# Altium project Smart Energy System.PrjPcb
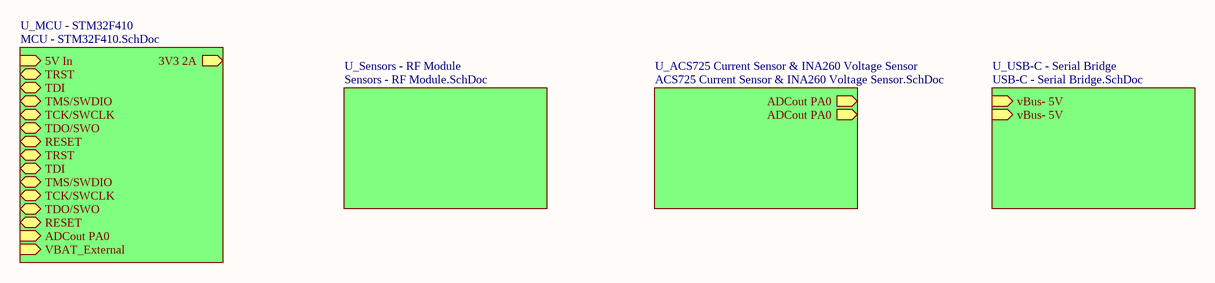
[diagram p0: Smart Energy Monitoring System.SchDoc]
6 sheets, 79 parts. Net scope: hierarchical (ports join the sheet entries above them; power ports are global).
Board file: Energy Managment System.PcbDoc
Sheets:
  Smart Energy Monitoring System.SchDoc
    U_MCU - STM32F410 = MCU - STM32F410.SchDoc
    U_Sensors - RF Module = Sensors - RF Module.SchDoc
    U_ACS725 Current Sensor & INA260 Voltage Sensor = ACS725 Current Sensor & INA260 Voltage Sensor.SchDoc
    U_USB-C - Serial Bridge = USB-C - Serial Bridge.SchDoc
  Functional Diagram.SchDoc

## Sheet Smart Energy Monitoring System.SchDoc
size A4; SheetNumber: 1; SheetTotal: 6

### Sub-sheets
U_ACS725 Current Sensor & INA260 Voltage Sensor = ACS725 Current Sensor & INA260 Voltage Sensor.SchDoc: ADCout PA0 (out), ADCout PA0 (out)
U_MCU - STM32F410 = MCU - STM32F410.SchDoc: 5V In (in), 3V3 2A (out), TRST (bidir), TDI (bidir), TMS/SWDIO (bidir), TCK/SWCLK (bidir), TDO/SWO (bidir), RESET (bidir), TRST (bidir), TDI (bidir), TMS/SWDIO (bidir), TCK/SWCLK (bidir), TDO/SWO (bidir), RESET (bidir), ADCout PA0 (in), VBAT_External (in)
U_Sensors - RF Module = Sensors - RF Module.SchDoc: no entries
U_USB-C - Serial Bridge = USB-C - Serial Bridge.SchDoc: vBus- 5V (in), vBus- 5V (in)

### Nets
NRST: sheet U_MCU - STM32F410/RESET, sheet U_MCU - STM32F410/RESET
NetJ?#1_3: sheet U_MCU - STM32F410/TRST, sheet U_MCU - STM32F410/TRST
NetJ?#1_5: sheet U_MCU - STM32F410/TDI, sheet U_MCU - STM32F410/TDI
NetJ?#1_7: sheet U_MCU - STM32F410/TMS/SWDIO, sheet U_MCU - STM32F410/TMS/SWDIO
NetJ?#1_9: sheet U_MCU - STM32F410/TCK/SWCLK, sheet U_MCU - STM32F410/TCK/SWCLK
NetJ?#1_13: sheet U_MCU - STM32F410/TDO/SWO, sheet U_MCU - STM32F410/TDO/SWO
(unnamed): sheet U_ACS725 Current Sensor & INA260 Voltage Sensor/ADCout PA0, sheet U_ACS725 Current Sensor & INA260 Voltage Sensor/ADCout PA0
(unnamed): sheet U_USB-C - Serial Bridge/vBus- 5V, sheet U_USB-C - Serial Bridge/vBus- 5V

## Sheet MCU - STM32F410.SchDoc
size A4; SheetNumber: 4; SheetTotal: 5
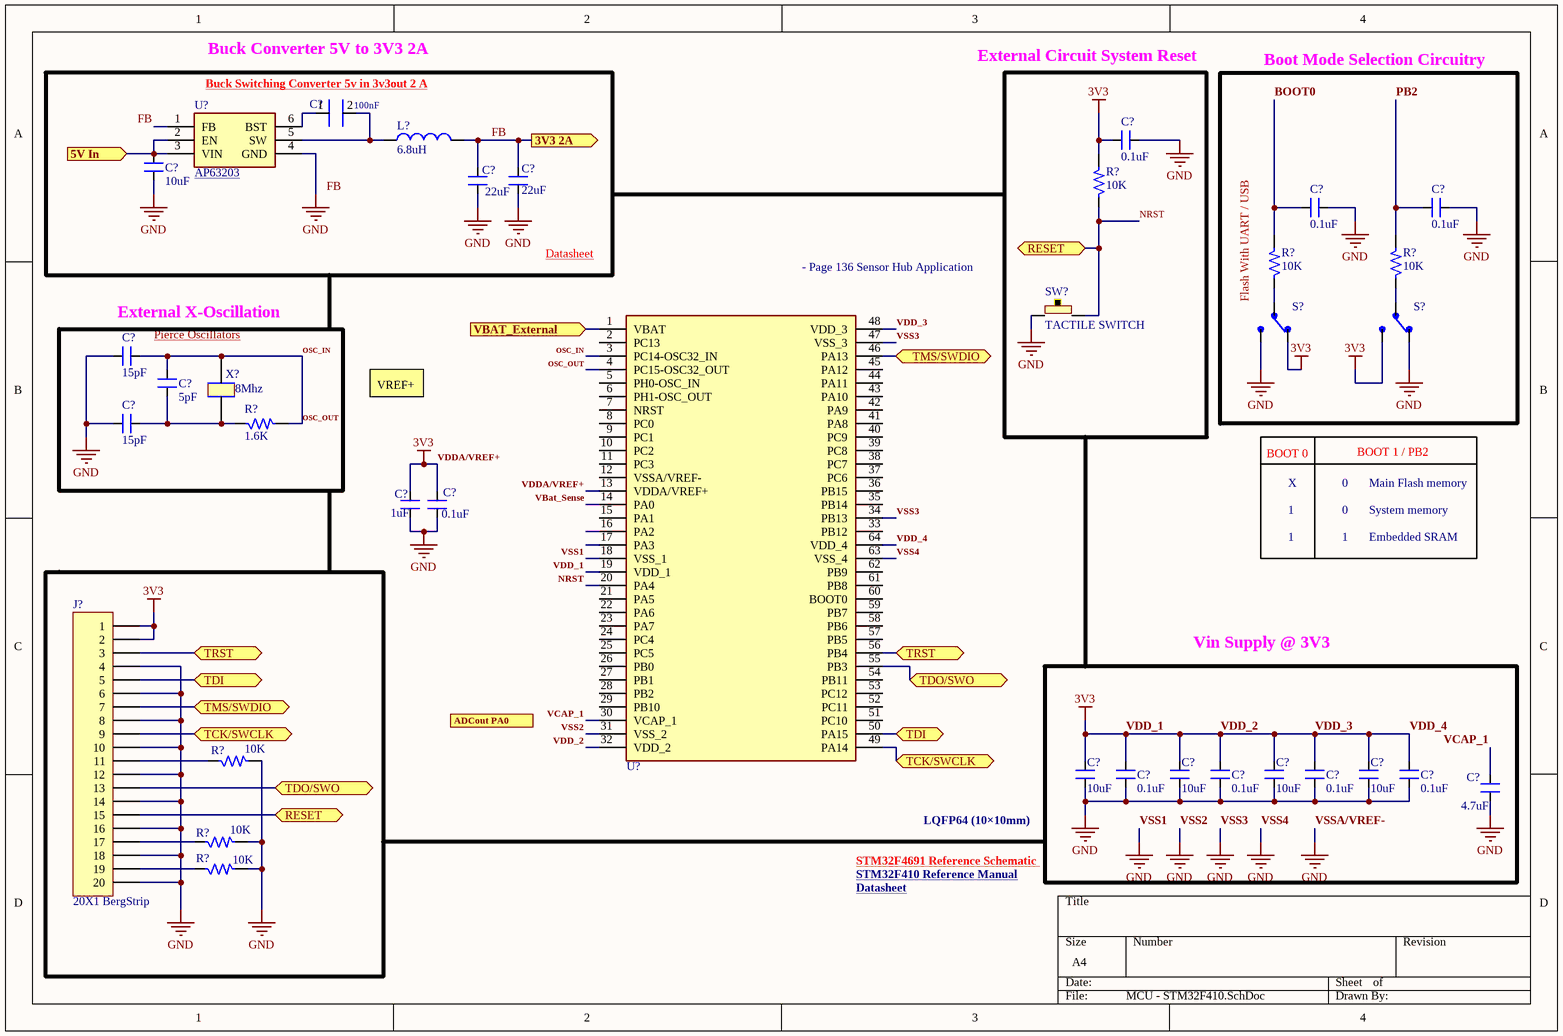
[diagram p1: MCU - STM32F410.SchDoc]

### Parts
(Parts that share a designator on the sheet are numbered #1, #2 ... from top to bottom, then left to right.)
C?#1  CC0402KPX7R7BB104  [Yageo_CC0402KPX]  (value not drawn)
C?#2  0.1uF  [CAP_0805]
C?#3  10uF  [CAP_0805]
C?#4  22uF  [CAP_0805]
C?#5  22uF  [CAP_0805]
C?#6  0.1uF  [CAP_0805]
C?#7  0.1uF  [CAP_0805]
C?#8  15pF  [CAP_0805]
C?#9  5pF  [RES_0603]
C?#10  15pF  [CAP_0805]
C?#11  1uF  [RES_0603]
C?#12  0.1uF  [CAP_0805]
C?#13  10uF  [RES_0603]
C?#14  0.1uF  [CAP_0805]
C?#15  10uF  [RES_0603]
C?#16  0.1uF  [CAP_0805]
C?#17  10uF  [RES_0603]
C?#18  0.1uF  [CAP_0805]
C?#19  10uF  [RES_0603]
C?#20  0.1uF  [CAP_0805]
C?#21  4.7uF  [CAP_0805]
J?#1  20X1 BergStrip  [CON20_100_40D72_TH_ST]
L?  6.8uH  [RES_0805]
R?#1  10K  [RES_0603]
R?#2  10K  [RES_0603]
R?#3  10K  [RES_0603]
R?#4  1.6K  [RES_0603]
R?#5  10K  [RES_0603]
R?#6  10K  [RES_0603]
R?#7  10K  [RES_0603]
S?#1  JS102011JCQN  (value not drawn)
S?#2  JS102011JCQN  (value not drawn)
SW?#1  TACTILE SWITCH  [SW_342_SMD]
U?#1  AP63203  [AP63203WU7]
U?#2  https://www.st.com/resource/en/datasheet/stm32f410cb.pdf  [QFP50P1200X1200X160-64N]  (value not drawn)
X?#1  8Mhz  [XTAL_314_240X47_SMD]

### Blocks framed on the sheet
Buck Converter 5V to 3V3 2A: C?#1 C?#3-C?#5 L? U?#1
Boot Mode Selection Circuitry: C?#6 C?#7 R?#2 R?#3 S?#1 S?#2
External X-Oscillation: C?#8-C?#10 R?#4 X?#1
Vin Supply @ 3V3: C?#13-C?#21

### Ports
3V3 2A (out), 5V In (in), ADCout PA0 (in), RESET (bidir), TCK/SWCLK (bidir), TDI (bidir), TDO/SWO (bidir), TMS/SWDIO (bidir), TRST (bidir), VBAT_External  (in)

### Nets
VDD_1: C?#2.2 C?#11.2 C?#12.1 C?#13.2 C?#14.1 C?#15.2 C?#16.1 C?#17.2 C?#18.1 C?#19.2 C?#20.1 J?#1.1 J?#1.2 R?#1.2 S?#1.1 S?#2.3 U?#2.13(VDDA/VREF+) U?#2.19(VDD_1) U?#2.32(VDD_2) U?#2.48(VDD_3) U?#2.64(VDD_4)  [also labelled 3V3, VDD_2, VDD_3, VDD_4, VDDA/VREF+]
VSS1: C?#2.1 C?#3.1 C?#4.1 C?#5.1 C?#6.1 C?#7.1 C?#8.2 C?#10.2 C?#11.1 C?#12.2 C?#13.1 C?#14.2 C?#15.1 C?#16.2 C?#17.1 C?#18.2 C?#19.1 C?#20.2 C?#21.1 J?#1.4 J?#1.6 J?#1.8 J?#1.10 J?#1.12 J?#1.14 J?#1.16 J?#1.18 J?#1.20 R?#5.2 R?#6.2 R?#7.2 S?#1.3 S?#2.1 SW?#1.1 U?#1.4(GND) U?#2.18(VSS_1) U?#2.31(VSS_2) U?#2.34(PB13) U?#2.47(VSS_3) U?#2.63(VSS_4)  [also labelled GND, VSS2, VSS3, VSS4, VSSA/VREF-]
BOOT0: C?#6.2 R?#2.2
FB: C?#4.2 C?#5.2 L?.2 U?#1.1(FB) ; port 3V3 2A
NRST: J?#1.15 R?#1.1 SW?#1.2 U?#2.20(PA4) ; port RESET
OSC_IN: C?#8.1 C?#9.2 R?#4.2 U?#2.3(PC14-OSC32_IN) U?#2.4(PC15-OSC32_OUT) X?#1.2  [also labelled OSC_OUT]
PB2: C?#7.2 R?#3.2
VBat_Sense: U?#2.14(PA0)
VCAP_1: C?#21.2 U?#2.30(VCAP_1)
NetC?#1_1: C?#1.1 U?#1.6(BST)
NetC?#1_2: C?#1.2 L?.1 U?#1.5(SW)
NetC?#3_2: C?#3.2 U?#1.2(EN) U?#1.3(VIN) ; port 5V In
NetC?#9_1: C?#9.1 C?#10.1 R?#4.1 X?#1.1
NetJ?#1_3: J?#1.3 U?#2.56(PB4) ; port TRST
NetJ?#1_5: J?#1.5 U?#2.50(PA15) ; port TDI
NetJ?#1_7: J?#1.7 U?#2.46(PA13) ; port TMS/SWDIO
NetJ?#1_9: J?#1.9 U?#2.49(PA14) ; port TCK/SWCLK
NetJ?#1_11: J?#1.11 R?#5.1
NetJ?#1_13: J?#1.13 U?#2.55(PB3) ; port TDO/SWO
NetJ?#1_17: J?#1.17 R?#6.1
NetJ?#1_19: J?#1.19 R?#7.1
NetR?#2_1: R?#2.1 S?#1.2
NetR?#3_1: R?#3.1 S?#2.2
NetU?#2_1: U?#2.1(VBAT) ; port VBAT_External 

Not connected (* = marked no-connect by the designer): U?#2 2(PC13) 5(PH0-OSC_IN) 6(PH1-OSC_OUT) 7(NRST) 8(PC0) 9(PC1) 10(PC2) 11(PC3) 12(VSSA/VREF-) 15(PA1) 16(PA2) 17(PA3) 21(PA5) 22(PA6) 23(PA7) 24(PC4) 25(PC5) 26(PB0) 27(PB1) 28(PB2) 29(PB10) 33(PB12) 35(PB14) 36(PB15) 37(PC6) 38(PC7) 39(PC8) 40(PC9) 41(PA8) 42(PA9) 43(PA10) 44(PA11) 45(PA12) 51(PC10) 52(PC11) 53(PC12) 54(PB11) 57(PB5) 58(PB6) 59(PB7) 60(BOOT0) 61(PB8) 62(PB9)

### Notes on the sheet
- Buck Switching Converter 5v in 3v3out 2 A <https://4donline.ihs.com/images/VipMasterIC/IC/DIOD/DIOD-S-A0007089856/DIOD-S-A0007089856-1.pdf?hkey=CECEF36DEECDED6468708AAF2E19C0C6>
- (near C?#1) 100nF
- External Circuit System Reset
- Datasheet <https://4donline.ihs.com/images/VipMasterIC/IC/DIOD/DIOD-S-A0007089856/DIOD-S-A0007089856-1.pdf?hkey=CECEF36DEECDED6468708AAF2E19C0C6>
- - Page 136 Sensor Hub Application
- Flash With UART / USB
- (near C?#8) Pierce Oscillators <https://www.st.com/resource/en/application_note/an2867-guidelines-for-oscillator-design-on-stm8afals-and-stm32-mcusmpus-stmicroelectronics.pdf>
- VREF+ is internally connected to VDDA and VREF- is internally connected to VSSA.
- BOOT 0
- X
- 1
- 0
- BOOT 1 / PB2
- Main Flash memory
- System memory
- Embedded SRAM
- LQFP64 (10×10mm)
- STM32F4691 Reference Schematic <https://wiki-power.com/en/STM32F4%E7%A1%AC%E4%BB%B6%E5%BC%80%E5%8F%91/>
- Datasheet <https://www.st.com/resource/en/datasheet/stm32f410cb.pdf>
- STM32F410 Reference Manual <https://www.st.com/resource/en/schematic_pack/mb1136-default-c04_schematic.pdf>
- Labels drawn without touching a wire or pin: FB

### Library data of the parts
C?#1 = CAP_100nF_0.1uF_10V_0402: Multilayer Ceramic Capacitor, 0.1 uF, 10 V, ± 10%, X7R, 0402 [1005 Metric]
C?#2 C?#6 C?#7 C?#12 C?#14 C?#16 C?#18 C?#20 = CAP_0.1uF-50V-10%-0805: 0.1µF ±10% 50V Ceramic Capacitor X7R 0805 (2012 Metric); Manufacturer: Samsung; Manufacturer Part Number: CL21B104KBCNNNC; Alternate Part Number-1: NA; Case/Package: 0805; Supplier-1: SIRICOM; Supplier Part Number-1: 0805B104K500CT
C?#3 = CAP_10uF-50V-10%-0805_1: 10µF ±10% 50V Ceramic Capacitor X7R 0805 (2012 Metric); Manufacturer: Samsung; Manufacturer Part Number: CL21B104KBCNNNC; Alternate Part Number-1: NA; Case/Package: 0805; Supplier-1: SIRICOM; Supplier Part Number-1: 0805B104K500CT
C?#4 C?#5 = CAP_22uF-25V-20%-0805: 22µF ±20% 25V Ceramic Capacitor X5R 0805 (2012 Metric); Manufacturer: Murata; Manufacturer Part Number: GRM21BR61E226ME44L; Alternate Part Number-1: NA; Case/Package: 0805; Supplier-1: LCSC; Supplier Part Number-1: C86816
C?#8 C?#10 = CAP_15pF-50V-10%-0805: 15pF ±5% 50V Ceramic Capacitor C0G, NP0 0805 (2012 Metric); Manufacturer: Kyocera AVX; Manufacturer Part Number: CC0805JRNPO9BN150; Alternate Part Number-1: NA; Case/Package: 0805; Supplier-1: SIRICOM; Supplier Part Number-1: 0805N150J500CT
C?#9 = CAP_GENERIC-0402: Generic capacitor Symbol; Manufacturer: NA; Manufacturer Part Number: NA; Case/Package: 0603; Supplier-1: NA; Supplier Part Number-1: NA; Alternate Part Number-1: NA
C?#11 C?#13 C?#15 C?#17 C?#19 = CAP_GENERIC_0603_1: Ceramic Capacitor C0G, NP0 0603 (2012 Metric); Manufacturer: Yageo; Manufacturer Part Number: 600F1R0BT250XT; Alternate Part Number-1: NA; Case/Package: 0805; Supplier-1: Mouser; Supplier Part Number-1: 581-600F1R0BT
C?#21 = CAP_4.7uF-50V-10%-0805: 4.7µF ±10% 50V Ceramic Capacitor X5R 0805 (2012 Metric); Manufacturer: Yageo; Manufacturer Part Number: GRM21BR61H475KE51L; Alternate Part Number-1: NA; Case/Package: 0805; Supplier-1: SIRICOM; Supplier Part Number-1: CL21A475KBQNNNE
J?#1 = CON-BS-PLG_20X1-100-ST-TH: 20 Pins, 1 Row 2.54mm Pitch, Straight bergstrip, Female; Manufacturer Part Number: NA; Case/Package: TH; Manufacturer: NA; Supplier-1: SP ROAD; Supplier Part Number-1: NA; Alternate Part Number-1: NA
L? = IND_0805_Generic: Manufacturer: Walsin; Manufacturer Part Number: WR08X1001FTL; Case/Package: 0805; Supplier-1: SP ROAD; Supplier Part Number-1: RC0805JR-071KL; Alternate Part Number-1: WR08X1001FTL
R?#1-R?#3 R?#5-R?#7 = RES_10K-0.1W-1%-0603: 10 kOhms ±1% 0.1W, 1/10W Chip Resistor 0603 (1608 Metric) Automotive AEC-Q200 Thick Film; Manufacturer: Walsin; Manufacturer Part Number: WR06X1002FTL; Alternate Part Number-1: 0603WAJ0103T5E; Case/Package: 0603; Supplier-1: SIRICOM; Supplier Part Number-1: WR06X1002FTL
R?#4 = RES_1.6K-0.1W-1%-0603: 1.6 kOhms ±1% 0.1W, 1/10W Chip Resistor 0603 (1608 Metric) Thin Film; Manufacturer: NA; Manufacturer Part Number: NA; Case/Package: 0603; Supplier-1: SIRICOM; Supplier Part Number-1: NA; Alternate Part Number-1: NA
S?#1 S?#2 = Switch Slide Spdt 300ma 6v: SPDT SMD
SW?#1 = SW1_RS-282G05A3-SMRT-SMD: Tactile Switch SPST-NO Top Actuated Surface Mount; Manufacturer: ITT C&K; Alternate Part Number-1: NA; Manufacturer Part Number: RS-282G05A3-SMRT; Case/Package: SMD; Supplier-1: SP ROAD; Supplier Part Number-1: RS-282G05A3-SMRT
U?#1 = IC_AP63203WU-7 Buck Converter 3V3 Out 2A: Switching Voltage Regulators DCDC Conv HV Buck TSOT26 T&R 3K
U?#2 = IC_STM32F410R8T6: STMICROELECTRONICS - STM32F410R8T6 - ARM MCU, STM32 Family STM32F4 Series Microcontrollers, ARM Cortex-M4F, 32bit, 100 MHz, 64 KB, 32 KB
X?#1 = XTAL_8MHZ-ECS-80-32-5PX-SMD: 8MHz ±30ppm Crystal 32pF 60 Ohms HC-49/US; Manufacturer: Fox Electronics; Manufacturer Part Number: ECS-80-32-5PX-TR; Alternate Part Number-1: NA; Case/Package: SMD/SMT; Supplier-1: SP ROAD; Supplier Part Number-1: ECS-80-32-5PX-TR

## Sheet Sensors - RF Module.SchDoc
size A4; SheetNumber: 5; SheetTotal: 5
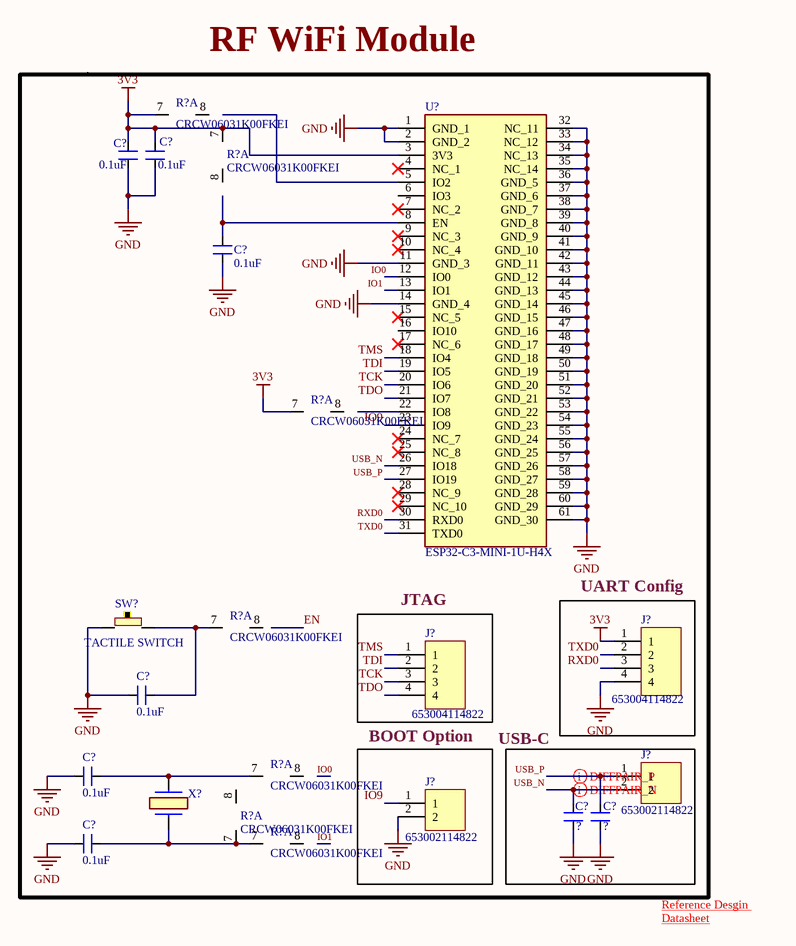
[diagram p2: Sensors - RF Module.SchDoc]

### Parts
(Parts that share a designator on the sheet are numbered #1, #2 ... from top to bottom, then left to right.)
C?#22  0.1uF  [RES_0603]
C?#23  0.1uF  [RES_0603]
C?#24  0.1uF  [RES_0603]
C?#25  0.1uF  [RES_0603]
C?#26  0.1uF  [RES_0603]
C?#27  ?  [RES_0603]
C?#28  ?  [RES_0603]
C?#29  0.1uF  [RES_0603]
J?#2  653004114822  [CON4_50_653004114822_TH_ST]
J?#3  653004114822  [CON4_50_653004114822_TH_ST]
J?#4  653002114822  [CON2_50_653002114822_TH_ST]
J?#5  653002114822  [CON2_50_653002114822_TH_ST]
R?#8  CRCW06031K00FKEI  [RES_0603]  (part A of 2)
R?#9  CRCW06031K00FKEI  [RES_0603]  (part A of 2)
R?#10  CRCW06031K00FKEI  [RES_0603]  (part A of 2)
R?#11  CRCW06031K00FKEI  [RES_0603]  (part A of 2)
R?#12  CRCW06031K00FKEI  [RES_0603]  (part A of 2)
R?#13  CRCW06031K00FKEI  [RES_0603]  (part A of 2)
R?#14  CRCW06031K00FKEI  [RES_0603]  (part A of 2)
SW?#2  TACTILE SWITCH  [SW_342_SMD]
U?#3  ESP32-C3-MINI-1U-H4X  [ESP32C3MINI1UH4X]
X?#2  XT1312HHRXX32K76E  [XT1312HHRXX32K76E]  (value not drawn)

### Blocks framed on the sheet
USB-C: C?#22-C?#29 J?#4 R?#8-R?#14 SW?#2 U?#3 X?#2
JTAG: J?#3
UART Config: J?#2
BOOT Option: J?#5

### Nets
3V3: C?#22.1 C?#23.2 J?#2.1 R?#8.7 R?#9.7 R?#10.7 U?#3.3(3V3)  [project net VDD_1]
GND: C?#22.2 C?#23.1 C?#24.1 C?#25.1 C?#26.1 C?#27.1 C?#28.1 C?#29.1 J?#2.4 J?#5.2 SW?#2.1 U?#3.1(GND_1) U?#3.2(GND_2) U?#3.11(GND_3) U?#3.14(GND_4) U?#3.32(NC_11) U?#3.33(NC_12) U?#3.34(NC_13) U?#3.35(NC_14) U?#3.36(GND_5) U?#3.37(GND_6) U?#3.38(GND_7) U?#3.39(GND_8) U?#3.40(GND_9) U?#3.41(GND_10) U?#3.42(GND_11) U?#3.43(GND_12) U?#3.44(GND_13) U?#3.45(GND_14) U?#3.46(GND_15) U?#3.47(GND_16) U?#3.48(GND_17) U?#3.49(GND_18) U?#3.50(GND_19) U?#3.51(GND_20) U?#3.52(GND_21) U?#3.53(GND_22) U?#3.54(GND_23) U?#3.55(GND_24) U?#3.56(GND_25) U?#3.57(GND_26) U?#3.58(GND_27) U?#3.59(GND_28) U?#3.60(GND_29) U?#3.61(GND_30)  [project net VSS1]
IO1: U?#3.13(IO1)
IO9: J?#5.1 U?#3.23(IO9)
RXD0: J?#2.3 U?#3.30(RXD0)
TCK: J?#3.3 U?#3.20(IO6)
TDI: J?#3.2 U?#3.19(IO5)
TDO: J?#3.4 U?#3.21(IO7)
TMS: J?#3.1 U?#3.18(IO4)
TXD0: J?#2.2 U?#3.31(TXD0)
USB_N: C?#27.2 J?#4.2 U?#3.26(IO18)
USB_P: C?#28.2 J?#4.1 U?#3.27(IO19)
NetC?#24_2: C?#24.2 U?#3.8(EN)
NetC?#25_2: C?#25.2 R?#11.7 SW?#2.2
NetC?#26_2: C?#26.2 R?#12.7 X?#2.2
NetC?#29_2: C?#29.2 R?#13.7 R?#14.7 X?#2.1

Not connected (* = marked no-connect by the designer): R?#8 8; R?#9 8; R?#10 8; R?#11 8; R?#12 8; R?#13 8; R?#14 8; U?#3 4(NC_1)* 5(IO2) 6(IO3) 7(NC_2)* 9(NC_3)* 10(NC_4)* 12(IO0) 15(NC_5)* 16(IO10) 17(NC_6)* 22(IO8) 24(NC_7)* 25(NC_8)* 28(NC_9)* 29(NC_10)*

### Layout directives
differential pair: USB_N, USB_P

### Notes on the sheet
- Reference Desgin <https://docs.espressif.com/projects/esp-hardware-design-guidelines/en/latest/esp32c3/schematic-checklist.html>
- Datasheet <https://documentation.espressif.com/esp32-c3-mini-1_datasheet_en.pdf>
- Labels drawn without touching a wire or pin: IO0, RF WiFi Module

### Library data of the parts
C?#22-C?#29 = CAP_GENERIC_0603_1: as C?#11 on sheet MCU - STM32F410; Case/Package: 0805; Supplier-1: Mouser; Supplier Part Number-1: 581-600F1R0BT
J?#2 J?#3 = CON-PLG_4X1-50-ST-TH: 4 Pins, 1 Row 1.25mm Pitch, straight Connector, male; Manufacturer: JST; Mating Part Number: 653004113322; Crimp Part Number: 653153128130; Alternate Part Number-1: NA; Manufacturer Part Number: 653004114822; Case/Package: TH-CON; Supplier-1: WURTH; Supplier Part Number-1: 653004114822
J?#4 J?#5 = CON-PLG_2X1-50-ST-TH: 2 Pins, 1 Row 1.25mm Pitch, Straight Connector, male; Manufacturer: JST; Mating Part Number: 653002113322; Crimp Part Number: 653153128130; Alternate Part Number-1: NA; Manufacturer Part Number: 653002114822; Case/Package: TH-CON; Supplier-1: WURTH; Supplier Part Number-1: 653002114822
R?#8-R?#14 = RES_1Kohm_0603: Thick Film Resistors - SMD D11/CRCW0603 100 1K0 1% ET2 E3
SW?#2 = SW1_RS-282G05A3-SMRT-SMD: as SW?#1 on sheet MCU - STM32F410; Manufacturer Part Number: RS-282G05A3-SMRT; Case/Package: SMD; Supplier-1: SP ROAD; Supplier Part Number-1: RS-282G05A3-SMRT
U?#3 = ESP32-C3-MINI-1U-H4X: Bluetooth, WiFi 802.11b/g/n, Bluetooth v5.0 Transceiver Module 2.412GHz ~ 2.484GHz Antenna Not Included, W.FL Surface Mount
X?#2 = XTAL Crystal 32.768KHz: 32.768 kHz +/-20ppm Crystal 12pF 70 kOhms 2-SMD, No Lead , -40C ~ 85C

## Sheet ACS725 Current Sensor & INA260 Voltage Sensor.SchDoc
size A4; SheetNumber: 4; SheetTotal: 6

## Sheet USB-C - Serial Bridge.SchDoc
size A4; SheetNumber: 5; SheetTotal: 6
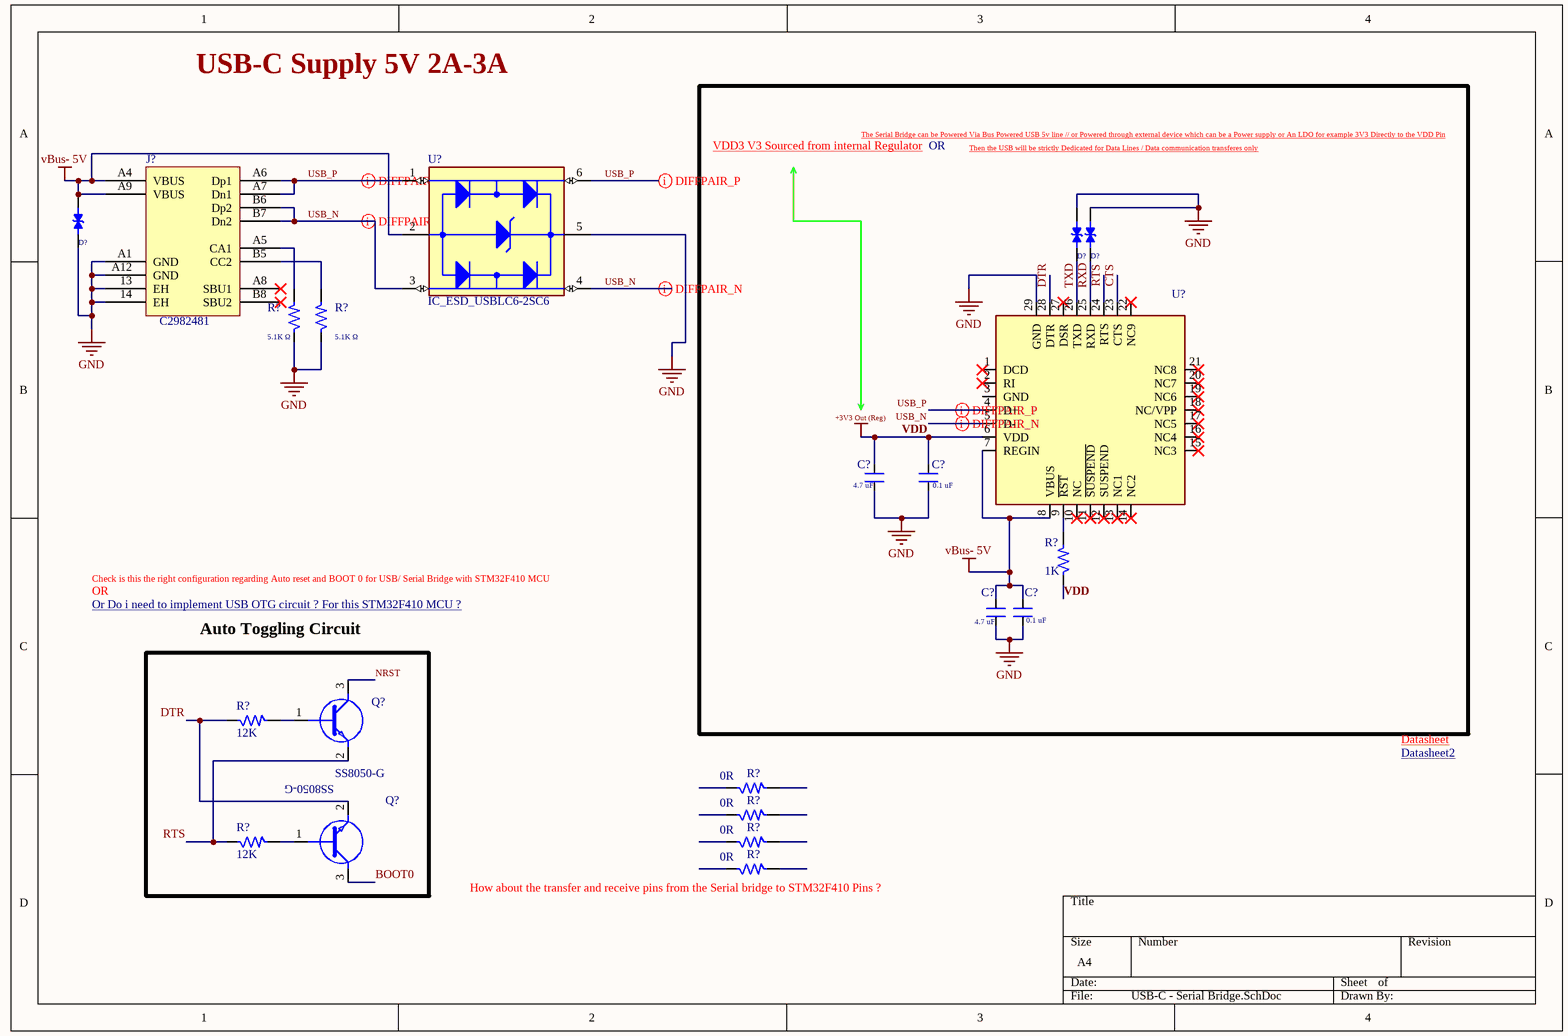
[diagram p3: USB-C - Serial Bridge.SchDoc]

### Parts
(Parts that share a designator on the sheet are numbered #1, #2 ... from top to bottom, then left to right.)
C?#30  4.7 uF  [RES_0603]
C?#31  0.1 uF  [RES_0603]
C?#32  4.7 uF  [RES_0603]
C?#33  0.1 uF  [RES_0603]
D?#1  LESD5D5.0CT1G  [LESD5D5.0CT1G]  (value not drawn)
D?#2  LESD5D5.0CT1G  [LESD5D5.0CT1G]  (value not drawn)
D?#3  LESD5D5.0CT1G  [LESD5D5.0CT1G]  (value not drawn)
J?#6  C2982481  [GT-USB-7079A]
Q?#1  SS8050-G  [BJT_NPN_SS8050-G]  (value not drawn)
Q?#2  SS8050-G  [BJT_NPN_SS8050-G]  (value not drawn)
R?#15  5.1K Ω  [RES_0603]
R?#16  5.1K Ω  [RES_0603]
R?#17  1K  [RES_0603]
R?#18  12K  [RES_0805]
R?#19  0R  [RES_0805]
R?#20  0R  [RES_0805]
R?#21  12K  [RES_0805]
R?#22  0R  [RES_0805]
R?#23  0R  [RES_0805]
U?#4  IC_ESD_USBLC6-2SC6  [USB-ESD-SOT95P280X145-6N]
U?#5  CP2102-GMR-QFN-28  [CP2102-GMR-USB-UART]  (value not drawn)

### Blocks framed on the sheet
Auto Toggling Circuit: Q?#1 Q?#2 R?#18 R?#21

### Nets
GND: C?#30.1 C?#31.1 C?#32.1 C?#33.1 D?#1.1 D?#2.2 D?#3.2 J?#6.13(EH) J?#6.14(EH) J?#6.A1(GND) J?#6.A12(GND) R?#15.1 R?#16.1 U?#4.5(VBUS) U?#5.29(GND)  [project net VSS1]
vBus- 5V: C?#32.2 C?#33.2 D?#1.2 J?#6.A4(VBUS) J?#6.A9(VBUS) U?#4.2(GND) U?#5.7(REGIN) U?#5.8(VBUS)
VDD: C?#30.2 C?#31.2 R?#17.1 U?#5.6(VDD)  [also labelled +3V3 Out (Reg)]
BOOT0: Q?#2.3(C)
CTS: U?#5.23(CTS)
DTR: Q?#2.2(E) R?#18.1 U?#5.28(DTR)
NRST: Q?#1.3(C)
RTS: Q?#1.2(E) R?#21.1 U?#5.24(RTS)
RXD: D?#3.1 U?#5.25(RXD)
TXD: D?#2.1 U?#5.26(TXD)
USB_N: J?#6.B6(Dp2) J?#6.B7(Dn2) U?#4.3(I/O2_IN) U?#4.4(I/O2_OUT) U?#5.5(D-)
USB_P: J?#6.A6(Dp1) J?#6.A7(Dn1) U?#4.1(I/O1_IN) U?#4.6(I/O1_OUT) U?#5.4(D+)
NetJ?#6_A5: J?#6.A5(CA1) R?#15.2
NetJ?#6_B5: J?#6.B5(CC2) R?#16.2
NetQ?#1_1: Q?#1.1(B) R?#18.2
NetQ?#2_1: Q?#2.1(B) R?#21.2
NetR?#17_2: R?#17.2 U?#5.9(~{RST})

Not connected (* = marked no-connect by the designer): J?#6 A8(SBU1)* B8(SBU2)*; R?#19 1 2; R?#20 1 2; R?#22 1 2; R?#23 1 2; U?#5 1(DCD)* 2(RI)* 3(GND) 10(NC)* 11(~{SUSPEND})* 12(SUSPEND)* 13(NC1)* 14(NC2)* 15(NC3)* 16(NC4)* 17(NC5)* 18(NC/VPP)* 19(NC6)* 20(NC7)* 21(NC8)* 22(NC9)* 27(DSR)*

### Layout directives
differential pair: USB_N, USB_P

### Notes on the sheet
- USB-C Supply 5V 2A-3A
- VDD3 V3 Sourced from internal Regulator
- The Serial Bridge can be Powered Via Bus Powered USB 5v line // or Powered through external device which can be a Power supply or An LDO for example 3V3 Directly to the VDD Pin
- OR
- Then the USB will be strictly Dedicated for Data Lines / Data communication transferes only
- Check is this the right configuration regarding Auto reset and BOOT 0 for USB/ Serial Bridge with STM32F410 MCU
- Or Do i need to implement USB OTG circuit ? For this STM32F410 MCU ? <https://www.google.com/search?q=USB+OTG+schematic+&sca_esv=7f9c333ee08b39a1&rlz=1C1ONGR_en-GBAU1190AU1192&udm=2&biw=1920&bih=945&sxsrf=AE3TifOh7c1v_j3b8hJNrGHXpSCEWAvt7A%3A1765691483216&ei=W1A-aa76DJC2vr0PnabzQA&ved=0ahUKEwjuk4-tsbyRAxUQm68BHR3THAgQ4dUDCBE&uact=5&oq=USB+OTG+schematic+&gs_lp=Egtnd3Mtd2l6LWltZyISVVNCIE9URyBzY2hlbWF0aWMgMgQQABgeMgYQABgFGB4yBhAAGAUYHjIGEAAYBRgeMgYQABgIGB4yBhAAGAgYHjIGEAAYCBgeMgYQABgIGB4yBhAAGAgYHjIIEAAYCBgKGB5I7UNQ5g1YgTlwBHgAkAEAmAHfAaABsBKqAQYwLjEzLjG4AQPIAQD4AQGYAg-gArcQwgIKEAAYgAQYQxiKBcICBhAAGAcYHsICBRAAGIAEwgIIEAAYBRgKGB6YAwCIBgGSBwYzLjExLjGgB_tKsgcGMC4xMS4xuAeoEMIHBjAuMS4xNMgHOoAIAA&sclient=gws-wiz-img#sv=CAMSVhoyKhBlLUxEYldTc2dTckVhZktNMg5MRGJXU3NnU3JFYWZLTToOZDJjSmpfYUFYS19WeE0gBCocCgZtb3NhaWMSEGUtTERiV1NzZ1NyRWFmS00YADABGAcgko3WwQcwAkoKCAIQAhgCIAIoAg>
- Datasheet <https://cdn.sparkfun.com/assets/c/7/7/b/f/cp2102.pdf>
- Datasheet2 <https://www.silabs.com/documents/public/data-sheets/CP2102-9.pdf>
- (near R?#23) How about the transfer and receive pins from the Serial bridge to STM32F410 Pins ?

### Library data of the parts
C?#30-C?#33 = CAP_GENERIC_0603_1: as C?#11 on sheet MCU - STM32F410; Case/Package: 0805; Supplier-1: Mouser; Supplier Part Number-1: 581-600F1R0BT
D?#1-D?#3 = DIO_Transient_VOl_Suppressor_ESD_PROTECTION: Transient Voltage Suppressors for ESD Protection
J?#6 = CON_USB-C_GT-USB-7079A: 5A 1 Surface Mount 16 Female -55℃~+85℃ Type-C SMD USB Connectors ROHS C2982481
Q?#1 Q?#2 = BJT_SS8050-G_NPN: Bipolar Transistors - BJT NPN TRANSISTOR 1.5A 40V
R?#15 R?#16 = RES_82K-0.1W-1%-0603: 82 kOhms ±1% 0.125W, 1/8W Chip Resistor 0603 (1608 Metric) Anti-Sulfur Thin Film; Manufacturer: Vishay Beyschlag; Manufacturer Part Number: MCT06030C8202FP500; Alternate Part Number-1: NA; Case/Package: 0603; Supplier-1: SIRICOM; Supplier Part Number-1: NA
R?#17 = RES_1K-0.1W-1%-0603: 1 kOhms ±1% 0.1W, 1/10W Chip Resistor 0603 (1608 Metric) Automotive AEC-Q200 Thick Film; Manufacturer: Walsin; Manufacturer Part Number: WR06X1001FTL; Alternate Part Number-1: 0603WAF1001T5E; Case/Package: 0603; Supplier-1: SIRICOM; Supplier Part Number-1: WR06X1001FTL
R?#18 R?#21 = RES_13K-0.125W-1%-0805: 13 kOhms ±1% 0.125W, 1/8W Chip Resistor 0805 (2012 Metric) Thick Film; Manufacturer: TE Connectivity Passive Product; Manufacturer Part NUMMBER: CRG0805F13K; Manufacturer Part Number: NA; Case/Package: 0805; Supplier-1: Siricom; Supplier Part Number-1: NA; Alternate Part Number-1: NA
R?#19 R?#20 R?#22 R?#23 = RES_0R-0.125W-1%-0805: 0 Ohms Jumper 0.125W, 1/8W Chip Resistor 0805 (2012 Metric) Automotive AEC-Q200 Thick Film; Manufacturer: Walsin; Manufacturer Part Number: WR08X000PTL; Case/Package: 0805; Supplier-1: SIRICOM; Supplier Part Number-1: WR08X000PTL; Alternate Part Number-1: WR08X000PTL
U?#4 = IC_ESD_USBLC6-2SC6: 17V Clamp 5A (8/20Âµs) Ipp Tvs Diode Surface Mount SOT-23-6; MF: STMicroelectronics; Value: *; SnapEDA_Link: https://www.snapeda.com/parts/USBLC6-2SC6/STMicroelectronics/view-part/?ref=snap; Check_prices: https://www.snapeda.com/parts/USBLC6-2SC6/STMicroelectronics/view-part/?ref=eda; Purchase-URL: https://pricing.snapeda.com/search/part/USBLC6-2SC6/?ref=eda; Price: None; Availability: In Stock; Package: SOT-23-6 STMicroelectronics; MP: USBLC6-2SC6
U?#5 = Serial-Bridge-INTERFACE-CP2102-GMR(QFN28): USB Bridge, USB to UART USB 2.0 UART Interface 28-QFN (5x5)

## Sheet Functional Diagram.SchDoc
size A4; SheetNumber: 6; SheetTotal: 6
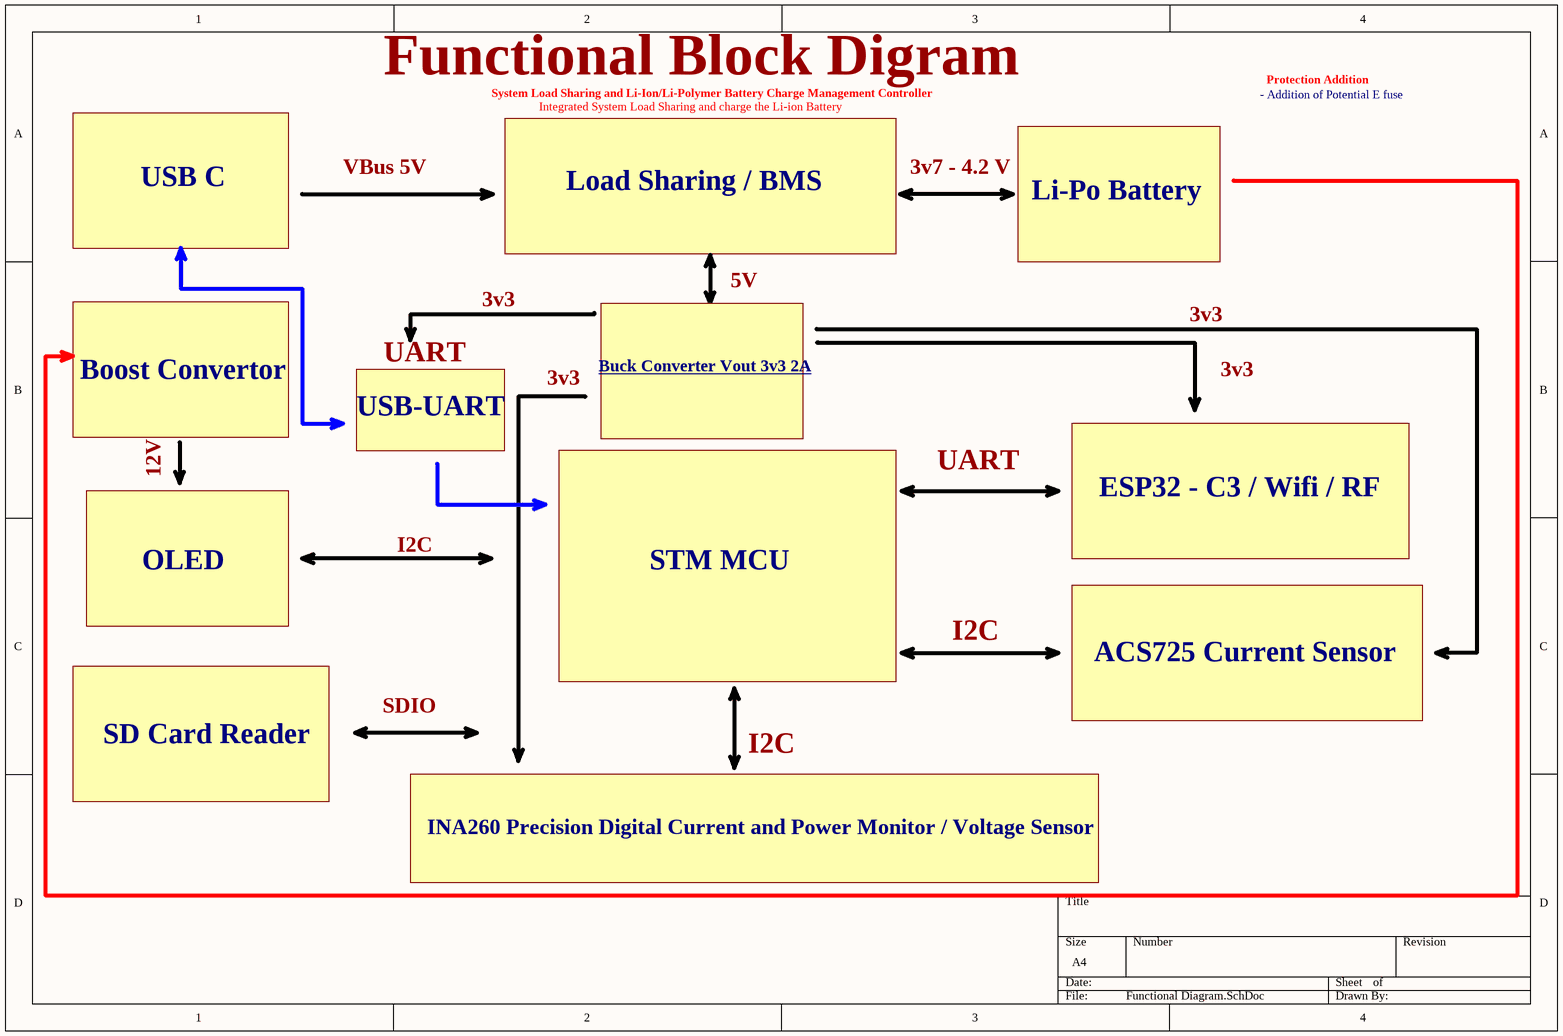
[diagram p4: Functional Diagram.SchDoc]

### Notes on the sheet
- Functional Block Digram
- System Load Sharing and Li-Ion/Li-Polymer Battery Charge Management Controller
- Integrated System Load Sharing and charge the Li-ion Battery
- - Addition of Potential E fuse
- Protection Addition
- VBus 5V
- 3v7 - 4.2 V
- USB C
- Load Sharing / BMS
- Li-Po Battery
- 3v3
- 5V
- Boost Convertor
- UART
- Buck Converter Vout 3v3 2A <https://4donline.ihs.com/images/VipMasterIC/IC/DIOD/DIOD-S-A0007089856/DIOD-S-A0007089856-1.pdf?hkey=CECEF36DEECDED6468708AAF2E19C0C6>
- USB-UART
- 12V
- ESP32 - C3 / Wifi / RF
- OLED
- I2C
- STM MCU
- SDIO
- ACS725 Current Sensor
- SD Card Reader
- INA260 Precision Digital Current and Power Monitor / Voltage Sensor

## Nets that join several sheets
VDD_1: MCU - STM32F410 (21 pins), Sensors - RF Module (7 pins)
VSS1: MCU - STM32F410 (40 pins), Sensors - RF Module (45 pins), USB-C - Serial Bridge (15 pins)